# Altium schematic sheet Part A.SchDoc
size A4; SheetNumber: 3; SheetTotal: 16
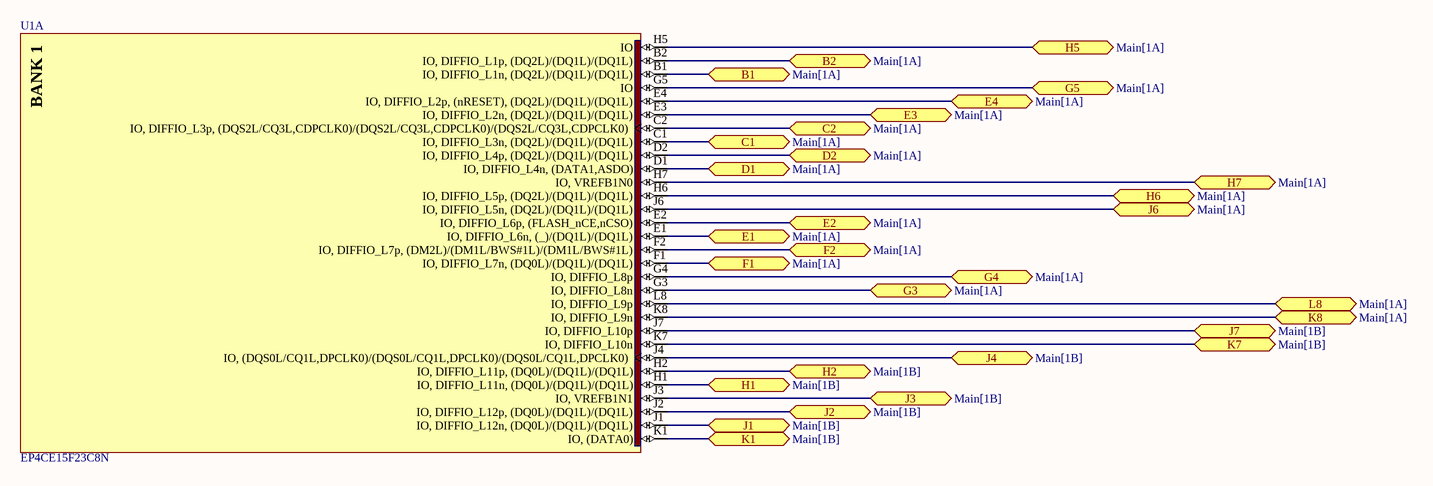
[diagram p0: Part A.SchDoc]

## Parts
U1  EP4CE15F23C8N  [FBGA484_A-240]  (part A of 13)

## Ports
B1 (bidir, see Main[1A]), B2 (bidir, see Main[1A]), C1 (bidir, see Main[1A]), C2 (bidir, see Main[1A]), D1 (bidir, see Main[1A]), D2 (bidir, see Main[1A]), E1 (bidir, see Main[1A]), E2 (bidir, see Main[1A]), E3 (bidir, see Main[1A]), E4 (bidir, see Main[1A]), F1 (bidir, see Main[1A]), F2 (bidir, see Main[1A]), G3 (bidir, see Main[1A]), G4 (bidir, see Main[1A]), G5 (bidir, see Main[1A]), H1 (bidir, see Main[1B]), H2 (bidir, see Main[1B]), H5 (bidir, see Main[1A]), H6 (bidir, see Main[1A]), H7 (bidir, see Main[1A]), J1 (bidir, see Main[1B]), J2 (bidir, see Main[1B]), J3 (bidir, see Main[1B]), J4 (bidir, see Main[1B]), J6 (bidir, see Main[1A]), J7 (bidir, see Main[1B]), K1 (bidir, see Main[1B]), K7 (bidir, see Main[1B]), K8 (bidir, see Main[1A]), L8 (bidir, see Main[1A])

## Nets
B1: U1.B1(IO,_DIFFIO_L1n,_(DQ2L)/(DQ1L)/(DQ1L)) ; port B1
B2: U1.B2(IO,_DIFFIO_L1p,_(DQ2L)/(DQ1L)/(DQ1L)) ; port B2
C1: U1.C1(IO,_DIFFIO_L3n,_(DQ2L)/(DQ1L)/(DQ1L)) ; port C1
C2: U1.C2(IO,_DIFFIO_L3p,_(DQS2L/CQ3L,CDPCLK0)/(DQS2L/CQ3L,CDPCLK0)/(DQS2L/CQ3L,CDPCLK0)) ; port C2
D1: U1.D1(IO,_DIFFIO_L4n,_(DATA1,ASDO)) ; port D1
D2: U1.D2(IO,_DIFFIO_L4p,_(DQ2L)/(DQ1L)/(DQ1L)) ; port D2
E1: U1.E1(IO,_DIFFIO_L6n,_(_)/(DQ1L)/(DQ1L)) ; port E1
E2: U1.E2(IO,_DIFFIO_L6p,_(FLASH_nCE,nCSO)) ; port E2
E3: U1.E3(IO,_DIFFIO_L2n,_(DQ2L)/(DQ1L)/(DQ1L)) ; port E3
E4: U1.E4(IO,_DIFFIO_L2p,_(nRESET),_(DQ2L)/(DQ1L)/(DQ1L)) ; port E4
F1: U1.F1(IO,_DIFFIO_L7n,_(DQ0L)/(DQ1L)/(DQ1L)) ; port F1
F2: U1.F2(IO,_DIFFIO_L7p,_(DM2L)/(DM1L/BWS#1L)/(DM1L/BWS#1L)) ; port F2
G3: U1.G3(IO,_DIFFIO_L8n) ; port G3
G4: U1.G4(IO,_DIFFIO_L8p) ; port G4
G5: U1.G5(IO) ; port G5
H1: U1.H1(IO,_DIFFIO_L11n,_(DQ0L)/(DQ1L)/(DQ1L)) ; port H1
H2: U1.H2(IO,_DIFFIO_L11p,_(DQ0L)/(DQ1L)/(DQ1L)) ; port H2
H5: U1.H5(IO) ; port H5
H6: U1.H6(IO,_DIFFIO_L5p,_(DQ2L)/(DQ1L)/(DQ1L)) ; port H6
H7: U1.H7(IO,_VREFB1N0) ; port H7
J1: U1.J1(IO,_DIFFIO_L12n,_(DQ0L)/(DQ1L)/(DQ1L)) ; port J1
J2: U1.J2(IO,_DIFFIO_L12p,_(DQ0L)/(DQ1L)/(DQ1L)) ; port J2
J3: U1.J3(IO,_VREFB1N1) ; port J3
J4: U1.J4(IO,_(DQS0L/CQ1L,DPCLK0)/(DQS0L/CQ1L,DPCLK0)/(DQS0L/CQ1L,DPCLK0)) ; port J4
J6: U1.J6(IO,_DIFFIO_L5n,_(DQ2L)/(DQ1L)/(DQ1L)) ; port J6
J7: U1.J7(IO,_DIFFIO_L10p) ; port J7
K1: U1.K1(IO,_(DATA0)) ; port K1
K7: U1.K7(IO,_DIFFIO_L10n) ; port K7
K8: U1.K8(IO,_DIFFIO_L9n) ; port K8
L8: U1.L8(IO,_DIFFIO_L9p) ; port L8

## Notes on the sheet
- (in symbol FPGA_EP4CE15F23C8N, part A) BANK 1

## Library data of the parts
U1 = FPGA_EP4CE15F23C8N: Cyclone IV Family FPGA, 1.2V Core, 343 I/O Pins, 4 PLLs, 484-Pin FBGA, Speed Grade 8, Commercial Grade, Pb-Free; Manufacturer: Altera; PackageVersion: ver1.0, Jun-2011; PackageReference: FBGA484_A-240; ComponentLink3URL: http://www.altera.com/literature/lit-dp.jsp?category=cyc%204&showspreadsheet=y; ComponentLink1Description: Manufacturer URL; DatasheetVersion: ver1.6, Nov-2011; ComponentLink3Description: Pinout; ComponentLink2URL: http://www.altera.com/literature/hb/cyclone-iv/cyclone4-handbook.pdf; ComponentLink1URL: http://www.altera.com/; ComponentLink2Description: Handbook; PackageDescription: 484-Pin FineLine Ball Grid Array (FBGA) - Wire Bond - A:2.40; Code_JEDEC: MS-034-AAJ-1; ComponentLink4URL: http://www.altera.com/devicepackaging/04R00247-02.pdf; ComponentLink4Description: Package Specification